# Altium schematic sheet 01_CMUT_TX.SchDoc
size A3; SheetNumber: 2; SheetTotal: 3
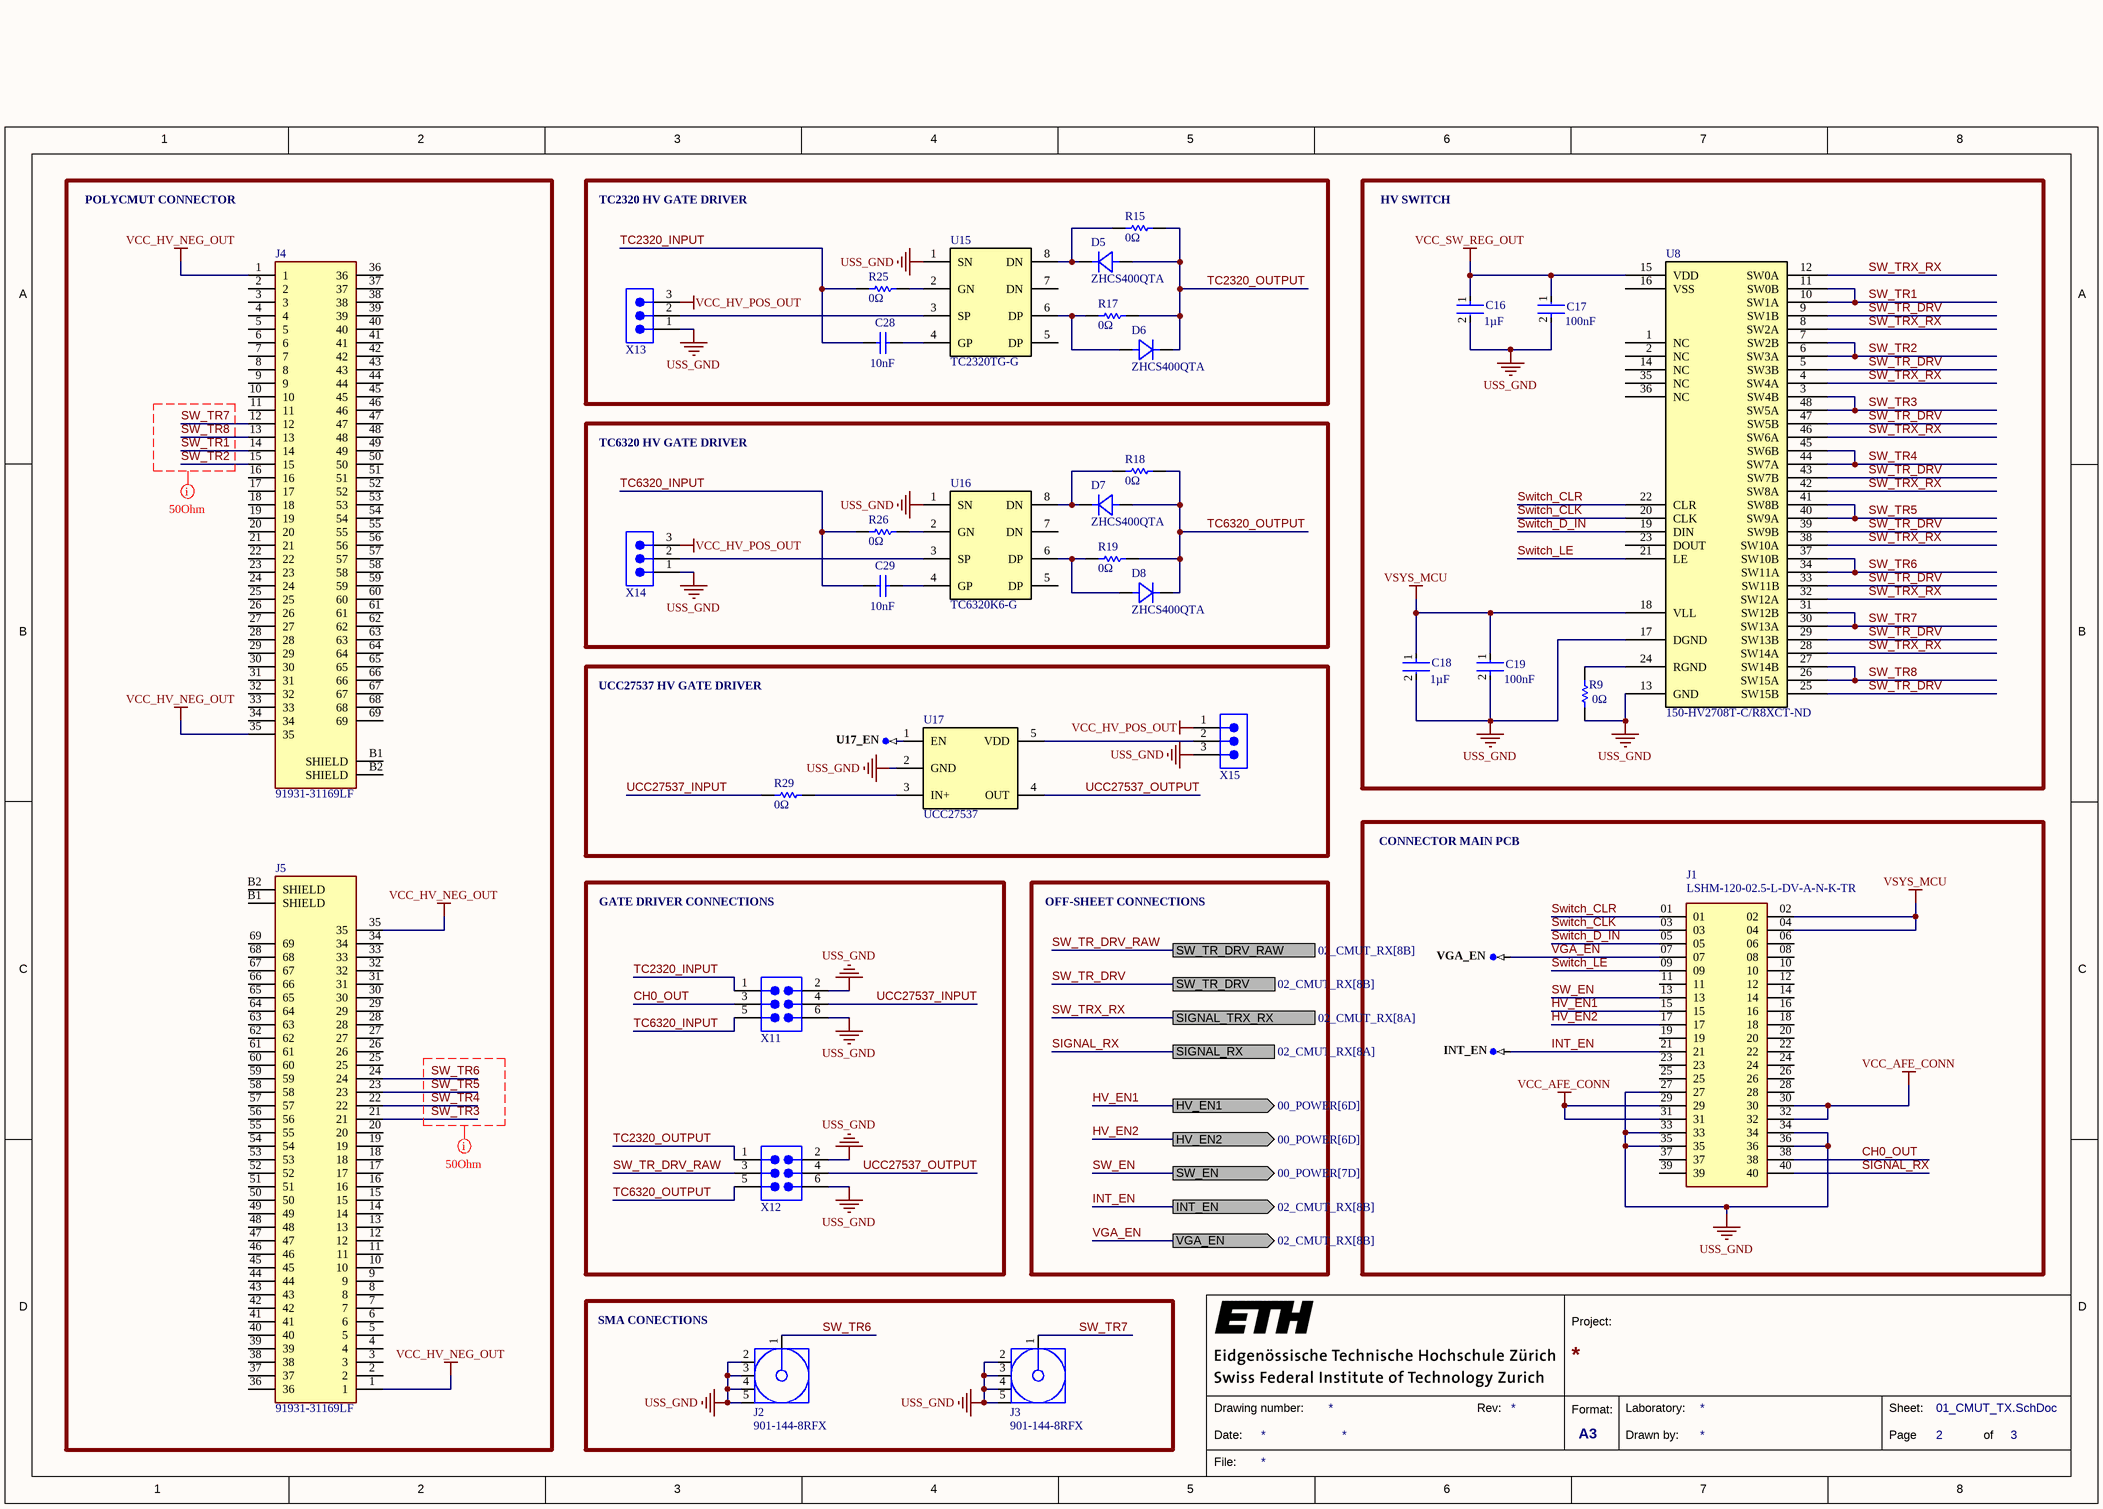
[diagram p0: 01_CMUT_TX.SchDoc]

## Parts
C16  Capacitance: 1µF  [FP-CGA3E-0_3-0_1-IPC_B]  (hidden comment: CGA3E3X5R1H105K)
C17  Capacitance: 100nF  [FP-C1608-080-0_1-MFG]  (hidden comment: C1608X5R1H104K080AA)
C18  Capacitance: 1µF  [FP-CGA3E-0_3-0_1-IPC_B]  (hidden comment: CGA3E3X5R1H105K)
C19  Capacitance: 100nF  [FP-C1608-080-0_1-MFG]  (hidden comment: C1608X5R1H104K080AA)
C28  Capacitance: 10nF  [CAPC1608X90X35NL15T15]  (hidden comment: 06035D103KAT2A)
C29  Capacitance: 10nF  [CAPC1608X90X35NL15T15]  (hidden comment: 06035D103KAT2A)
D5  ZHCS400QTA  [DIODE_SOD323_DIO]
D6  ZHCS400QTA  [DIODE_SOD323_DIO]
D7  ZHCS400QTA  [DIODE_SOD323_DIO]
D8  ZHCS400QTA  [DIODE_SOD323_DIO]
INT_EN  TP-SM-C-100  [TP-SM-C-100]  (value not drawn)  (no BOM)
J1  LSHM-120-02.5-L-DV-A-N-K-TR  [SAMTEC_LSHM-120-XX.X-X-DV-A-N-XX]
J2  901-144-8RFX  [AMPH-901-144-8RFX_V]
J3  901-144-8RFX  [AMPH-901-144-8RFX_V]
J4  91931-31169LF  [FRAMETOME_91931-31169LF]
J5  91931-31169LF  [FRAMETOME_91931-31169LF]
R9  Resistance: 0Ω  [RESC1608X55X25NL10T15]  (hidden comment: RC0603JR-130RL)
R15  Resistance: 0Ω  [RESC1608X55X25NL10T15]  (hidden comment: RC0603JR-130RL)
R17  Resistance: 0Ω  [RESC1608X55X25NL10T15]  (hidden comment: RC0603JR-130RL)
R18  Resistance: 0Ω  [RESC1608X55X25NL10T15]  (hidden comment: RC0603JR-130RL)
R19  Resistance: 0Ω  [RESC1608X55X25NL10T15]  (hidden comment: RC0603JR-130RL)
R25  Resistance: 0Ω  [RESC1608X55X25NL10T15]  (hidden comment: RC0603JR-130RL)
R26  Resistance: 0Ω  [RESC1608X55X25NL10T15]  (hidden comment: RC0603JR-130RL)
R29  Resistance: 0Ω  [RESC1608X55X25NL10T15]  (hidden comment: RC0603JR-130RL)
U8  Supplier Part Number 1: 150-HV2708T-C/R8XCT-ND  [LQFP48_7X7MC_MCH]  (hidden comment: HV2708T-C/R8X)
U15  TC2320TG-G  [SOIC127P599X173-8N]
U16  TC6320K6-G  [SOIC127P599X173-8N]
U17  UCC27537  [SOT95P280X145-5N]
U17_EN  TP-SM-C-100  [TP-SM-C-100]  (value not drawn)  (no BOM)
VGA_EN  TP-SM-C-100  [TP-SM-C-100]  (value not drawn)  (no BOM)
X11  67996-106HLF  [67996-106HLF]  (value not drawn)
X12  67996-106HLF  [67996-106HLF]  (value not drawn)
X13  68000-103HLF  [68000-103HLF]  (value not drawn)
X14  68000-103HLF  [68000-103HLF]  (value not drawn)
X15  68000-103HLF  [68000-103HLF]  (value not drawn)

## Blocks framed on the sheet
POLYCMUT CONNECTOR: J4 J5
TC2320 HV GATE DRIVER: C28 D5 D6 R15 R17 R25 U15 X13
HV SWITCH: C16-C19 R9 U8
TC6320 HV GATE DRIVER: C29 D7 D8 R18 R19 R26 U16 X14
UCC27537 HV GATE DRIVER: R29 U17 U17_EN X15
CONNECTOR MAIN PCB: INT_EN J1 VGA_EN
GATE DRIVER CONNECTIONS: X11 X12
SMA CONECTIONS: J2 J3

## Ports
HV_EN1 (out, see 00_POWER[6D]), HV_EN2 (out, see 00_POWER[6D]), INT_EN (out, see 02_CMUT_RX[8B]), SIGNAL_RX (see 02_CMUT_RX[8A]), SIGNAL_TRX_RX (see 02_CMUT_RX[8A]), SW_EN (out, see 00_POWER[7D]), SW_TR_DRV (see 02_CMUT_RX[8B]), SW_TR_DRV_RAW (see 02_CMUT_RX[8B]), VGA_EN (out, see 02_CMUT_RX[8B])

## Nets
USS_GND: C16.2 C17.2 C18.2 C19.2 J1.27 J1.33 J1.34 J1.35 J1.36 J2.2 J2.3 J2.4 J2.5 J3.2 J3.3 J3.4 J3.5 R9.1 U8.13(GND) U8.17(DGND) U15.1(SN) U16.1(SN) U17.2(GND) X11.2 X11.6 X12.2 X12.6 X13.1 X14.1 X15.3
VCC_AFE_CONN: J1.29 J1.30 J1.31 J1.32
VCC_HV_NEG_OUT: J4.1 J4.35 J5.1 J5.35
VCC_HV_POS_OUT: X13.3 X14.3 X15.1
VCC_SW_REG_OUT: C16.1 C17.1 U8.15(VDD)
VSYS_MCU: C18.1 C19.1 J1.02 J1.04 U8.18(VLL)
CH0_OUT: J1.38 X11.3
HV_EN1: J1.15 ; port HV_EN1
HV_EN2: J1.17 ; port HV_EN2
INT_EN: INT_EN.1 J1.21 ; port INT_EN
SIGNAL_RX: J1.40 ; port SIGNAL_RX
SW_EN: J1.13 ; port SW_EN
SW_TR1: J4.14 U8.10(SW1A) U8.11(SW0B)
SW_TR2: J4.15 U8.6(SW3A) U8.7(SW2B)
SW_TR3: J5.21 U8.3(SW4B) U8.48(SW5A)
SW_TR4: J5.22 U8.44(SW7A) U8.45(SW6B)
SW_TR5: J5.23 U8.40(SW9A) U8.41(SW8B)
SW_TR6: J2.1 J5.24 U8.34(SW11A) U8.37(SW10B)
SW_TR7: J3.1 J4.12 U8.30(SW13A) U8.31(SW12B)
SW_TR8: J4.13 U8.26(SW15A) U8.27(SW14B)
SW_TR_DRV: U8.5(SW3B) U8.9(SW1B) U8.25(SW15B) U8.29(SW13B) U8.33(SW11B) U8.39(SW9B) U8.43(SW7B) U8.47(SW5B) ; port SW_TR_DRV
SW_TR_DRV_RAW: X12.3 ; port SW_TR_DRV_RAW
SW_TRX_RX: U8.4(SW4A) U8.8(SW2A) U8.12(SW0A) U8.28(SW14A) U8.32(SW12A) U8.38(SW10A) U8.42(SW8A) U8.46(SW6A) ; port SIGNAL_TRX_RX
Switch_CLK: J1.03 U8.20(CLK)
Switch_CLR: J1.01 U8.22(CLR)
Switch_D_IN: J1.05 U8.19(DIN)
Switch_LE: J1.09 U8.21(LE)
TC2320_INPUT: C28.1 R25.2 X11.1
TC2320_OUTPUT: D5.2 D6.1 R15.1 R17.1 X12.1
TC6320_INPUT: C29.1 R26.2 X11.5
TC6320_OUTPUT: D7.2 D8.1 R18.1 R19.1 X12.5
UCC27537_INPUT: R29.2 X11.4
UCC27537_OUTPUT: U17.4(OUT) X12.4
VGA_EN: J1.07 VGA_EN.1 ; port VGA_EN
NetC28_2: C28.2 U15.4(GP)
NetC29_2: C29.2 U16.4(GP)
NetD5_1: D5.1 R15.2 U15.8(DN)
NetD6_2: D6.2 R17.2 U15.6(DP)
NetD7_1: D7.1 R18.2 U16.8(DN)
NetD8_2: D8.2 R19.2 U16.6(DP)
NetR9_2: R9.2 U8.24(RGND)
NetR25_1: R25.1 U15.2(GN)
NetR26_1: R26.1 U16.2(GN)
NetR29_1: R29.1 U17.3(IN+)
NetU15_3: U15.3(SP) X13.2
NetU16_3: U16.3(SP) X14.2
NetU17_1: U17.1(EN) U17_EN.1
NetU17_5: U17.5(VDD) X15.2

Not connected (* = marked no-connect by the designer): J1 06 08 10 11 12 14 16 18 19 20 22 23 24 25 26 28 37 39; J4 2 3 4 5 6 7 8 9 10 11 16 17 18 19 20 21 22 23 24 25 26 27 28 29 30 31 32 33 34 36 37 38 39 40 41 42 43 44 45 46 47 48 49 50 51 52 53 54 55 56 57 58 59 60 61 62 63 64 65 66 67 68 69 B1(SHIELD) B2(SHIELD); J5 2 3 4 5 6 7 8 9 10 11 12 13 14 15 16 17 18 19 20 25 26 27 28 29 30 31 32 33 34 36 37 38 39 40 41 42 43 44 45 46 47 48 49 50 51 52 53 54 55 56 57 58 59 60 61 62 63 64 65 66 67 68 69 B1(SHIELD) B2(SHIELD); U8 1(NC) 2(NC) 14(NC) 16(VSS) 23(DOUT) 35(NC) 36(NC); U15 5(DP) 7(DN); U16 5(DP) 7(DN)

## Layout directives
net class *: SW_TR1, SW_TR2, SW_TR3, SW_TR4, SW_TR5, SW_TR6, SW_TR7, SW_TR8

## Notes on the sheet
- OFF-SHEET CONNECTIONS
- 1
- 2
- 3
- 4
- 5
- 6
- 7
- 8
- A
- B
- C
- D
- Project:
- Date:
- Drawing number:
- Rev:
- Format:
- A3
- Drawn by:
- Laboratory:
- Page
- Sheet:
- of
- File:

## Library data of the parts
C16 C18 = CMP-08246-000317-1: Cap Ceramic 1uF 50V X5R 10% Pad SMD 0603 +85°C Automotive T/R; Termination: SMD/SMT; Tolerance: 10%; Case Code (Metric): 1608; Max Operating Temperature: 85°C; Case/Package: 0603; Voltage Rating: 50V; Dielectric: X5R; Case Code (Imperial): 0603; Packaging: Tape and Reel; Min Operating Temperature: -55°C; Voltage Rating (DC): 50V
C17 C19 = CMP-08246-002719-1: Multilayer Ceramic Capacitors 100nF ±10% 50V X5R SMD 0603; Radiation Hardening: No; Length: 1.6mm; Package Quantity: 1; Thickness: 0.035inch; Max Operating Temperature: 85°C; Series: C; RoHS Compliant: Yes; Weight: 7.1E-05oz; Resistor Type: Ceramic; Case/Package: 0603; Voltage Rating: 50V; Tolerance: 10%; Width: 0.031inch; Voltage Rating (DC): 50V; Termination: SMD/SMT; Case Code (Metric): 1608; Construction: Flat; Mount: Surface Mount; Dielectric Material: Ceramic; Number of Pins: 2; Lead Free: Lead Free; Packaging: Tape and Reel; Min Operating Temperature: -55°C; Dielectric: X5R; Case Code (Imperial): 0603; Depth: 0.8mm; Height: 0.8mm; REACH SVHC: No SVHC
C28 C29 = CMP-2006-04462-1: Manufacturer: AVX Interconnect / Elco; Part Number: 06035D103KAT2A
D5-D8 = ZHCS400QTA: Diode Schottky 40V 1A Automotive 2-Pin SOD-323 T/R; Manufacturer: Diodes; Supplier 1: Farnell; RoHS: Yes; Category: Rectifier Diodes; Stock 1: 385; Pricing 1: 5=0.87300, 10=0.73400, 100=0.49400, 500=0.38800 (CHF); Mount: Surface Mount; Packaging: Tape and Reel; Average Rectified Current: 1A; Max Reverse Voltage (DC): 40V; RoHS Compliant: Yes; ComponentLink1URL: http://www.mouser.com/ds/2/115/ZHCS400Q-959646.pdf?src-supplier=Mouser; ComponentLink1Description: http://www.mouser.com/ds/2/115/ZHCS400Q-959646.pdf?src-supplier=Mouser; Supplier Part Number 1: 3127490; Manufacturer Part Number: ZHCS400QTA
INT_EN U17_EN VGA_EN = CMP-0484-00002-2: Test Point, Surface Mount, Circular, Pad Diameter 1 mm; Manufacturer: No Vendor; PartNumber: TP-SM-C-100
J1 = LSHM-120-02.5-L-DV-A-N-K-TR: Conn Socket and Terminal Strip HDR/SKT 40 POS 0.5mm Solder ST SMD T/R; Manufacturer: Samtec; Number of Contacts: 40; Supplier 1: Digi-Key; RoHS: Yes; Category: Connectors; Stock 1: 3008; Pricing 1: 1=6.60000, 10=5.97000, 25=5.63960, 50=5.50200, 100=5.22690, 250=4.67672 (USD); Contact Plating: Gold; Contact Material: Bronze; Housing Color: Black; Housing Material: Polymer; Min Operating Temperature: -55°C; Max Operating Temperature: 125°C; Number of Rows: 2; Termination: Solder; Packaging: Tape and Reel; Orientation: Straight; Series: LSH; Length: 14.7mm; Pitch: 0.5mm; Depth: 4.98mm; Radiation Hardening: No; REACH SVHC: No SVHC; RoHS Compliant: Yes; ComponentLink1URL: http://www.farnell.com/datasheets/2372721.pdf?src-supplier=Farnell; ComponentLink1Description: http://www.farnell.com/datasheets/2372721.pdf?src-supplier=Farnell; ComponentLink2URL: http://www.farnell.com/datasheets/2000266.pdf?src-supplier=Farnell; ComponentLink2Description: http://www.farnell.com/datasheets/2000266.pdf?src-supplier=Farnell; ComponentLink3URL: http://components.arrow.com/part/dataview/0323_01943898?src-supplier=Arrow+Europe; ComponentLink3Description: http://components.arrow.com/part/dataview/0323_01943898?src-supplier=Arrow+Europe; ComponentLink4URL: http://components.arrow.com/part/dataview/48680868S8397842N1004?src-supplier=Arrow+Electronics; ComponentLink4Description: http://components.arrow.com/part/dataview/48680868S8397842N1004?src-supplier=Arrow+Electronics; ComponentLink5URL: http://www.farnell.com/datasheets/2000266.pdf?src-supplier=Element14; ComponentLink5Description: http://www.farnell.com/datasheets/2000266.pdf?src-supplier=Element14; ComponentLink6URL: http://suddendocs.samtec.com/prints/lshm-1xx-xx.x-xx-dv-a-x-x-tr-mkt.pdf?src-supplier=Digi-Key; ComponentLink6Description: http://suddendocs.samtec.com/prints/lshm-1xx-xx.x-xx-dv-a-x-x-tr-mkt.pdf?src-supplier=Digi-Key; ComponentLink7URL: ftp://ftp.samtec.com/webfiles/PDF/LSHM.PDF?src-supplier=Avnet; ComponentLink7Description: ftp://ftp.samtec.com/webfiles/PDF/LSHM.PDF?src-supplier=Avnet; ComponentLink8URL: ftp://ftp.samtec.com/webfiles/PDF/LSHM.PDF?src-supplier=Avnet+Europe; ComponentLink8Description: ftp://ftp.samtec.com/webfiles/PDF/LSHM.PDF?src-supplier=Avnet+Europe; ComponentLink9URL: http://www.farnell.com/datasheets/2372721.pdf?src-supplier=Newark; ComponentLink9Description: http://www.farnell.com/datasheets/2372721.pdf?src-supplier=Newark; Supplier Part Number 1: SAM13196CT-ND; Manufacturer Part Number: LSHM-120-02.5-L-DV-A-N-K-TR
J2 J3 = CMP-2000-05706-1: Coaxial Connector, 18 GHz, 50 Ohm, -65 to 165 degC, 5-Pin THD, RoHS, Bulk; Manufacturer: Amphenol; Contact Termination: Solder; Dielectric Material: Polytetrafluoroethylene(PTFE); Frequency - Max: 18GHz; Body Material: Brass; Other Names: 901-144-8-RFX9011448RFXARFX1231; Center Contact Plating: Gold; Connector Type: Jack,FemaleSocket; Center Contact Material: BerylliumCopper; Impedance: 50Ohm; 3D Model: 901-144-8RFX.igs; Online Catalog: SMA,RFX; Connector Style: SMA; Category: Connectors,Interconnects; Housing Color: Gold; Mounting Type: ThroughHole; Ingress Protection: -; Packaging: Bulk; Features: -; Fastening Type: Threaded; Series: -; Standard Package: 1; Shield Termination: Solder; Mounting Technology: SurfaceMount; Family: CoaxialConnectors(RF); Package Reference: 901-144-8RFX; Datasheet URL: https://datasheet.ciiva.com/23676/c901-144-8rfx-23676337.pdf; Package Description: 5-Pin Through Hole Device, Body 7 x 7 mm, Pitch 2.54 mm; Cable Group: -; Datasheet Version: Rev. A, 01/2001; Body Finish: Gold; Operating Temperature: -65°C~165°C; Voltage Rating: -; Manufacturer URL: http://www.amphenol.com/
J4 J5 = 91931-31169LF: Conn; Rect; Industrial; MezzanineRECP; 69Cnts; SMT; I-IndustrialSeries; Package: None; Price: None; Value: *; MP: 91931-31169LF; Availability: Unavailable
R9 R15 R17-R19 R25 R26 R29 = CMP-2000-04311-1: Manufacturer: Yageo; Part Number: RC0603JR-130RL
U8 = HV2708T-C/R8X: 16-CH 200V No Hv Bias Switch (SPST), 1 Bleed Resistor 48 LQFP 7X7X1.4MM T/r Rohs Compliant: Yes; Manufacturer: Microchip; Supplier 1: Digi-Key; Manufacturer Part Number: HV2708T-C/R8X; RoHS: Yes; Category: Decoders and Multiplexers; Stock 1: 440; Pricing 1: 1=19.01000, 25=15.84720, 100=14.65500 (USD)
U15 U16 = TC2320: 8L SOIC N-Channel and P-Channel Enhancement-Mode Dual MOSFET
U17 = UCC27537: 5P SOT-23 DBV MOSFET IGBT Single-Gate-Driver
X11 X12 = CMP-00150-2: 6 Positions Header, Unshrouded Connector 0.100" (2.54mm) Through Hole Gold or Gold, GXT™; Manufacturer: Amphenol FCI; Connector Type: Male Pin; Number of Positions: 6; Row Spacing: 0.1inch; Current Rating: 3A; Gender: Male; Insulation Resistance: 5GR; Mating Post Length: 5.84mm; Max Voltage Rating (AC): 1.5kV; Packaging: Bulk; Pitch: 2.54mm; Number of Rows: 2; Contact Mating Length: 0.23inch; Termination: Solder; Manufacturer Part Number: 67996-106HLF; Supplier: Digikey; Supplier Part Number: 609-3202-ND; ComponentLink1Description: 67996-16726269.pdf; ComponentLink1URL: https://datasheet.ciiva.com/16726/67996-16726269.pdf; Case/Package: 100; Colour: Black; ComponentLink2Description: 1876884-46393071.pdf; ComponentLink2URL: https://datasheet.ciiva.com/46393/1876884-46393071.pdf; ComponentLink3Description: 67996-728918.pdf; ComponentLink3URL: https://datasheet.ciiva.com/728/67996-728918.pdf; ComponentLink4Description: 67996-10149181.pdf; ComponentLink4URL: https://datasheet.ciiva.com/10149/67996-10149181.pdf; Contact Gender: Male; Contact Material: Bronze; Contact Plating: Nickel,Gold,GXT; Depth: 4.83mm; Flammability Rating: UL94 V-0; Housing Colour: Black; Housing Material: Thermoplastic; Length: 7.62mm; Max Operating Temperature: 125°C; Min Operating Temperature: -65°C; Number of Contacts: 6; Orientation: Straight; Package Quantity: 100; Radiation Hardening: No; REACH SVHC: No SVHC; Termination Post Length: 2.41mm; Voltage Rating: 1.5kV
X13-X15 = CMP-00101-2: 3 Positions Header, Unshrouded Connector 0.100" (2.54mm) Through Hole Gold or Gold, GXT™; Manufacturer: Amphenol FCI; Current Rating: 3A; Insulation Resistance: 5GR; Number of Positions: 3; Max Voltage Rating (AC): 1.5kV; Termination: Solder; Fastening Type: -; Features: -; Contact Finish: Gold or Gold, GXT™; Contact Finish Thickness: 15µin (0.38µm); Color: Black; Supplier: Digikey; Supplier Part Number: 609-3461-ND; ComponentLink1Description: 68000-274283-5157301.pdf; ComponentLink1URL: https://datasheet.ciiva.com/5157/68000-274283-5157301.pdf; Depth: 2.41mm; Flammability Rating: UL94 V-0; Housing Colour: Black; Housing Material: Thermoplastic; Length: 7.62mm; Manufacturer Part Number: 68000-103HLF; Max Operating Temperature: 125°C; Packaging: Bulk; Contact Type: Male Pin; Connector Type: Header, Unshrouded; Pitch: 2.54mm; Number of Rows: 1; Contact Mating Length: 0.230" (5.84mm); Mounting Type: Through Hole; Min Operating Temperature: -65°C; Number of Contacts: 3; Orientation: Straight; Package Quantity: 100; Radiation Hardening: No; REACH SVHC: No SVHC; Termination Post Length: 2.41mm; Voltage Rating: 1.5kV; Contact Gender: Male; Contact Material: Bronze; Contact Plating: Nickel,Gold,GXT; ComponentLink2Description: 68000-731071.pdf; ComponentLink2URL: https://datasheet.ciiva.com/731/68000-731071.pdf; ComponentLink3Description: 68000-10149754.pdf; ComponentLink3URL: https://datasheet.ciiva.com/10149/68000-10149754.pdf; ComponentLink4Description: 1914865-46392021.pdf; ComponentLink4URL: https://datasheet.ciiva.com/46392/1914865-46392021.pdf